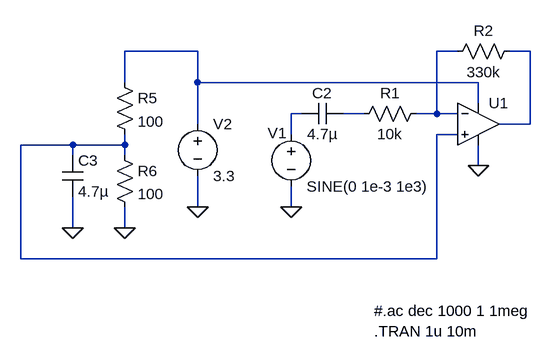
[diagram p0: schematic MCP6271_example.asc]
MCP6271_example.asc, the LTspice schematic file:
Version 4
SHEET 1 880 816
WIRE -352 160 -464 160
WIRE 48 160 16 160
WIRE 160 160 128 160
WIRE -464 208 -464 160
WIRE -352 208 -352 160
WIRE 80 208 -352 208
WIRE 80 240 80 208
WIRE -192 256 -208 256
WIRE -96 256 -128 256
WIRE 16 256 16 160
WIRE 16 256 -16 256
WIRE 48 256 16 256
WIRE -352 272 -352 208
WIRE 160 272 160 160
WIRE 160 272 112 272
WIRE -208 288 -208 256
WIRE 48 288 16 288
WIRE -544 304 -624 304
WIRE -464 304 -464 288
WIRE -464 304 -544 304
WIRE -544 320 -544 304
WIRE -464 320 -464 304
WIRE 80 336 80 304
WIRE -352 400 -352 352
WIRE -208 400 -208 368
WIRE -544 432 -544 384
WIRE -464 432 -464 400
WIRE -624 480 -624 304
WIRE 16 480 16 288
WIRE 16 480 -624 480
FLAG 80 336 0
FLAG -208 400 0
FLAG -352 400 0
FLAG -464 432 0
FLAG -544 432 0
SYMBOL voltage -208 272 R0
WINDOW 0 -36 14 Left 2
SYMATTR InstName V1
SYMATTR Value SINE(0 1e-3 1e3)
SYMATTR SpiceLine Rser=0 Cpar=0
SYMATTR Value2 AC 1 0
SYMBOL voltage -352 256 R0
SYMATTR InstName V2
SYMATTR Value 3.3
SYMATTR SpiceLine Rser=0
SYMBOL res 0 240 R90
WINDOW 0 0 56 VBottom 2
WINDOW 3 32 56 VTop 2
SYMATTR InstName R1
SYMATTR Value 10k
SYMBOL res 144 144 R90
WINDOW 0 0 56 VBottom 2
WINDOW 3 32 56 VTop 2
SYMATTR InstName R2
SYMATTR Value 330k
SYMBOL cap -128 240 R90
WINDOW 0 0 32 VBottom 2
WINDOW 3 32 32 VTop 2
SYMATTR InstName C2
SYMATTR Value 4.7µ
SYMBOL res -480 192 R0
SYMATTR InstName R5
SYMATTR Value 100
SYMBOL res -480 304 R0
SYMATTR InstName R6
SYMATTR Value 100
SYMBOL cap -560 320 R0
SYMATTR InstName C3
SYMATTR Value 4.7µ
SYMBOL OpAmps/UniversalOpAmp 80 272 R0
SYMATTR InstName U1
SYMATTR Value2 Avol=3.16e5 GBW=2Meg Vos=3e-3
SYMATTR SpiceLine En=20e-9 Enk=346e-9 In=3e-15 Ib=1e-12 Rin=500Meg
TEXT -80 560 Left 2 !#.ac dec 1000 1 1meg\n.TRAN 1u 10m

The netlist it stands for:
* MCP6271_example.asc
V1 N004 0 SINE(0 1e-3 1e3) AC 1 0 Rser=0 Cpar=0
V2 N001 0 3.3 Rser=0
R1 N002 N005 10k
R2 N003 N002 330k
C2 N005 N004 4.7µ
R5 N001 N006 100
R6 N006 0 100
C3 N006 0 4.7µ
XU1 N006 N002 N001 0 N003 level1 Avol=3.16e5 GBW=2Meg Vos=3e-3 En=20e-9 Enk=346e-9 In=3e-15 Ib=1e-12 Rin=500Meg  ; pins In+ In- V+ V- OUT
#.ac dec 1000 1 1meg
.TRAN 1u 10m
.lib UniversalOpAmp1.lib
.backanno
.end